# EAGLE design index (EAGLE 9.5.2)
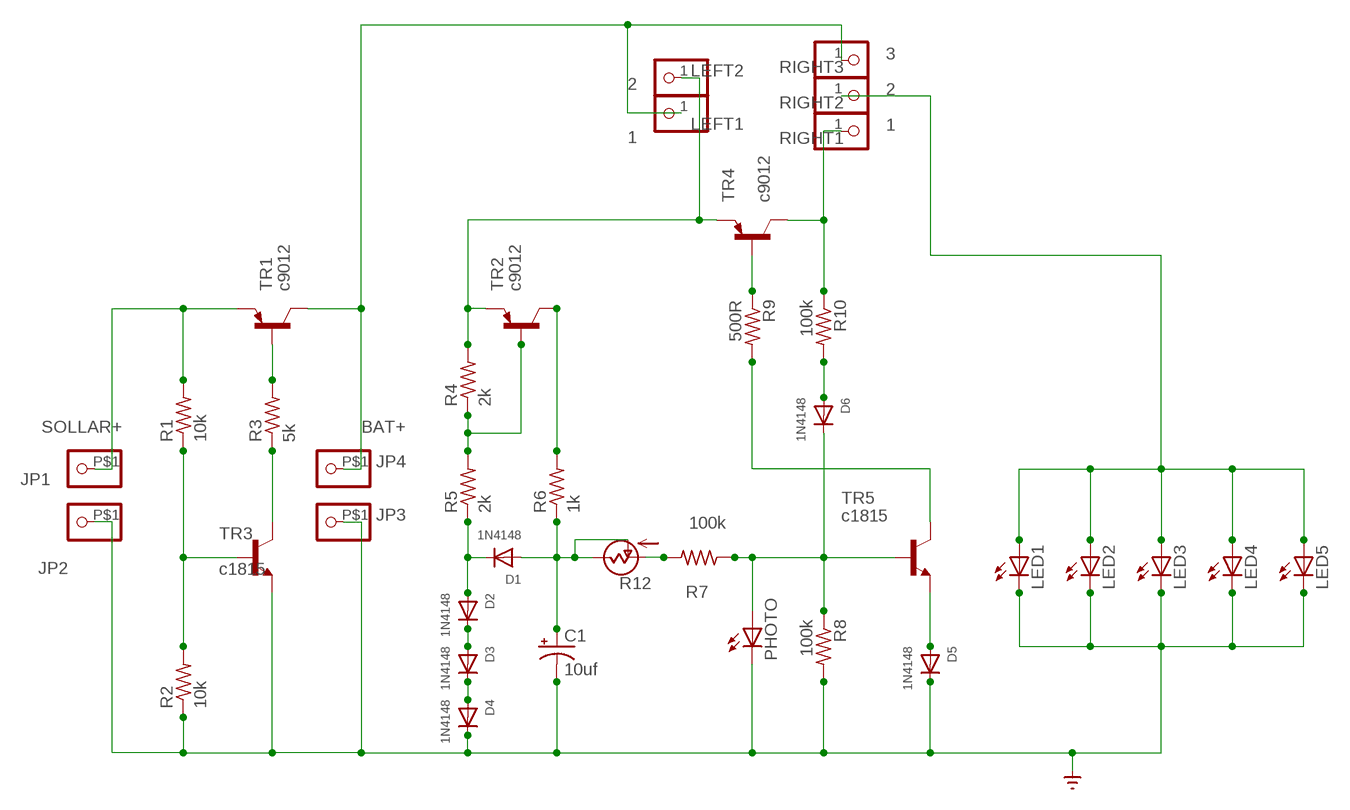
[diagram p0: schematic, sheet 1]

## Parts
C1  10uf  CAP_POLPTH2  [CPOL-RADIAL-10UF-25V]
D1  1N4148  DIODEDO-1N4148  [DO-1N4148]
D2  1N4148  DIODEDO-1N4148  [DO-1N4148]
D3  1N4148  DIODEDO-1N4148  [DO-1N4148]
D4  1N4148  DIODEDO-1N4148  [DO-1N4148]
D5  1N4148  DIODEDO-1N4148  [DO-1N4148]
D6  1N4148  DIODEDO-1N4148  [DO-1N4148]
JP1  PINHD-1X1-BIGPOGO  [1X1-BIGPOGO]
JP2  PINHD-1X1-BIGPOGO  [1X1-BIGPOGO]
JP3  PINHD-1X1-BIGPOGO  [1X1-BIGPOGO]
JP4  PINHD-1X1-BIGPOGO  [1X1-BIGPOGO]
LED1  LED3MM  [LED3MM]
LED2  LED3MM  [LED3MM]
LED3  LED3MM  [LED3MM]
LED4  LED3MM  [LED3MM]
LED5  LED3MM  [LED3MM]
LEFT1  1  PINHD-1X1CB  [1X01-CLEANBIG]
LEFT2  2  PINHD-1X1CB  [1X01-CLEANBIG]
PHOTO  LED3MM  [LED3MM]
R1  10k  R-US_0207/9  [0207/9]
R2  10k  R-US_0207/9  [0207/9]
R3  5k  R-US_0207/9  [0207/9]
R4  2k  R-US_0207/9  [0207/9]
R5  2k  R-US_0207/9  [0207/9]
R6  1k  R-US_0207/9  [0207/9]
R7  100k  R-US_0207/9  [0207/9]
R8  100k  R-US_0207/9  [0207/9]
R9  500R  R-US_0207/9  [0207/9]
R10  100k  R-US_0207/9  [0207/9]
R12  POTTRECP10S  [ECP10S]
RIGHT1  1  PINHD-1X1CB  [1X01-CLEANBIG]
RIGHT2  2  PINHD-1X1CB  [1X01-CLEANBIG]
RIGHT3  3  PINHD-1X1CB  [1X01-CLEANBIG]
TR1  c9012  2N2907  [TO92-EBC-OVAL]
TR2  c9012  2N2907  [TO92-EBC-OVAL]
TR3  c1815  BC639-NPN-TO92-ECB  [TO92-ECB]
TR4  c9012  2N2907  [TO92-EBC-OVAL]
TR5  c1815  BC639-NPN-TO92-ECB  [TO92-ECB]

## Nets
BAT+: JP4.P$1 LEFT1.1 RIGHT3.1 TR1.C
GND: C1.2(-) D4.C D5.C JP2.P$1 JP3.P$1 LED1.K(C) LED2.K(C) LED3.K(C) LED4.K(C) LED5.K(C) PHOTO.K(C) R2.1 R8.2 TR3.E ; supply symbol labelled SUPPLY0_GND_
N$1: R1.1 R2.2 TR3.B
N$4: R3.1 TR3.C
N$6: R3.2 TR1.B
N$7: D1.C D2.A R5.1
N$8: D2.C D3.A
N$9: D3.C D4.A
N$10: LEFT2.1 R4.2 TR2.E TR4.E
N$11: R4.1 R5.2 TR2.B
N$12: R6.2 TR2.C
N$13: C1.1(+) D1.A R6.1 R12.E(VSS) R12.S(OUT)
N$14: D6.C PHOTO.A R7.1 R8.1 TR5.B
N$15: D5.A TR5.E
N$16: R9.2 TR5.C
N$17: R9.1 TR4.B
N$18: R10.1 RIGHT1.1 TR4.C
N$19: D6.A R10.2
N$21: R7.2 R12.A(VDD)
N$23: LED1.A LED2.A LED3.A LED4.A LED5.A RIGHT2.1
SOLLAR+: JP1.P$1 R1.2 TR1.E

## Library data of the parts
C1 = barthess:CAP_POL: Capacitor Polarized These are standard SMD and PTH capacitors. Normally 10uF, 47uF, and 100uF in electrolytic and tantalum varieties. Always verify the external diameter of the through hole cap, it varies with capacity, voltage, and manufacturer. The EIA devices should be standard.
D1-D6 = adafruit:DIODE: Diode SMADIODE - SMA Surface Mount Package 20V 1A Schottky Diode Digikey: 641-1014-6-ND DO-1N4148 - Through Hole Small Current Diode SOD-123 20V 1 A (.5mV Vf) Schottky Diode - Digikey: MBRX120TPMSCT-ND SOD-323 10V 570mA (.38mV Vf, 3ns) Schottky Diode - Digikey: ZLLS410CT-ND SOD-523 30V 30mA Schottky Diode (RB751S-40TE61) - Digikey: RB751S-40TE61CT-ND SOT23-R/W - SOT23 Package (R = Solder Paste/Reflow Ovens, W = Hand-Soldering) BAT54Film 40V 300mA - Digikey: 497-7162-1-ND
JP1-JP4 LEFT1 LEFT2 RIGHT1-RIGHT3 = adafruit:PINHD-1X1: Pin header 1x1 for 0.1" spacing With round pins
LED1-LED5 PHOTO = adafruit:LED: LED OSRAM: - CHIPLED LG R971, LG N971, LY N971, LG Q971, LY Q971, LO R971, LY R971 LH N974, LH R974 LS Q976, LO Q976, LY Q976 LO Q996 - Hyper CHIPLED LW Q18S LB Q993, LB Q99A, LB R99A - SideLED LS A670, LO A670, LY A670, LG A670, LP A670 LB A673, LV A673, LT A673, LW A673 LH A674 LY A675 LS A676, LA A676, LO A676, LY A676, LW A676 LS A679, LY A679, LG A679 - Hyper Micro SIDELED® LS Y876, LA Y876, LO Y876, LY Y876 LT Y87S - SmartLED LW L88C, LW L88S LB L89C, LB L89S, LG L890 LS L89K, LO L89K, LY L89K LS L896, LA L896, LO L896, LY L896 - TOPLED LS T670, LO T670, LY T670, LG T670, LP T670 LSG T670, LSP T670, LSY T670, LOP T670, LYG T670 LG T671, LOG T671, LSG T671 LB T673, LV T673, LT T673, LW T673 LH T674 LS T676, LA T676, LO T676, LY T676, LB T676, LH T676, LSB T676, LW T676 LB T67C, LV T67C, LT T67C, LS T67K, LO T67K, LY T67K, LW E67C LS E67B, LA E67B, LO E67B, LY E67B, LB E67C, LV E67C, LT E67C LW T67C LS T679, LY T679, LG T679 LS T770, LO T770, LY T770, LG T770, LP T770 LB T773, LV T773, LT T773, LW T773 LH T774 LS E675, LA E675, LY E675, LS T675 LS T776, LA T776, LO T776, LY T776, LB T776 LHGB T686 LT T68C, LB T68C - Hyper Mini TOPLED® LB M676 - Mini TOPLED Santana® LG M470 LS M47K, LO M47K, LY M47K Source: http://www.osram.convergy.de/
R1-R10 = adafruit:R-US_: RESISTOR, American symbol
R12 = tango:POTTR: POTENTIOMETER
TR1 TR2 TR4 = adafruit:2N2907*: PNP Transistor Big Oval pads
TR3 TR5 = transistor:*-NPN-: NPN Transistror BF959 corrected 2008.03.06

## Board
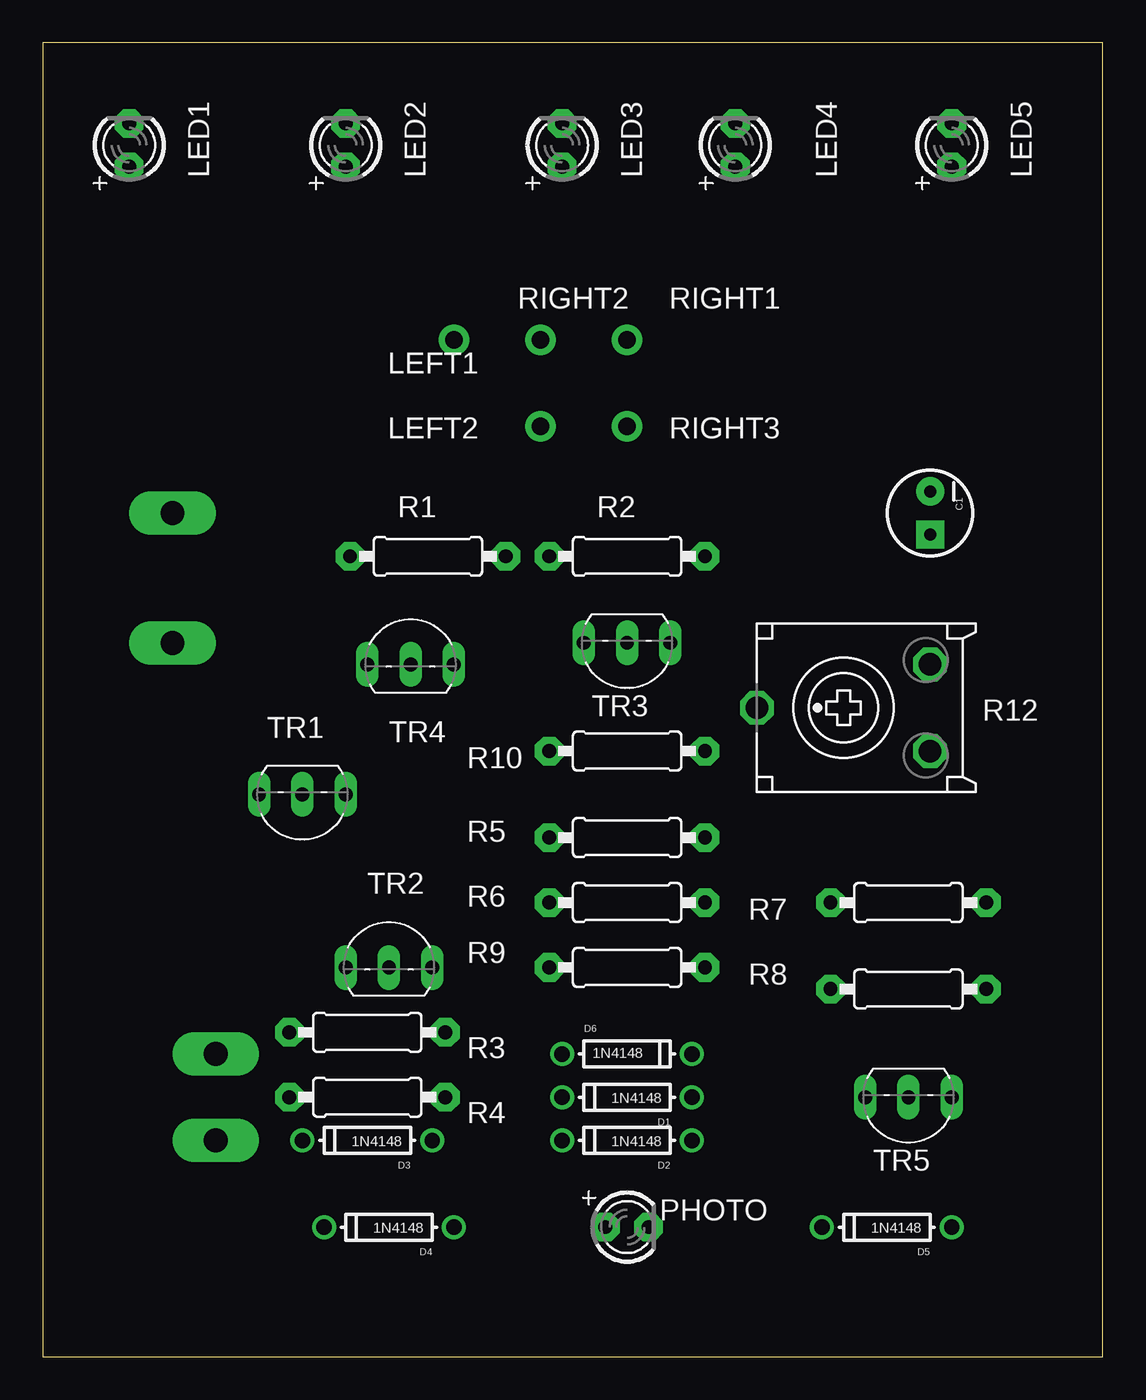
[diagram p1: board, top side]
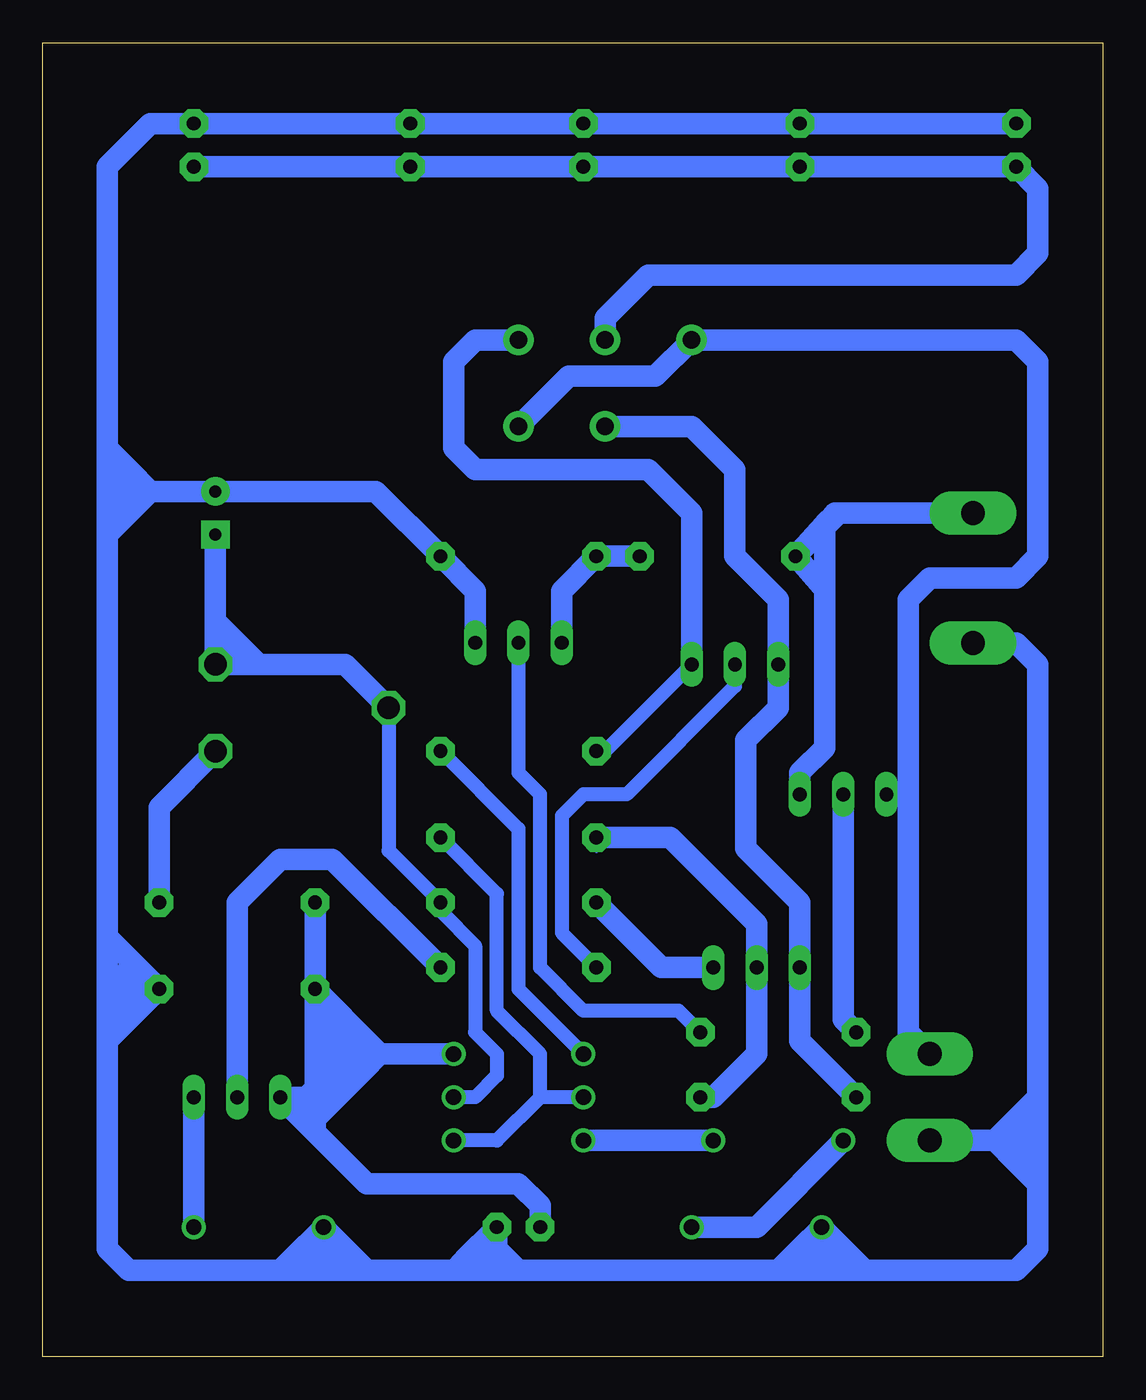
[diagram p2: board, bottom side, seen from below]

Size 62.21 x 77.14 mm. Coordinates in mm from the lower left corner, seen from the top.
Outline: 0,0 62.21,0 62.21,77.14 0,77.14 0,0
Copper layers (1*16): Top 0.035mm / dielectric 1.5mm / Bottom 0.035mm
Design rules "default": minimum track width 6mil, minimum drill 0.35mm, track to track 6mil, track to pad 6mil, pad to pad 6mil, via to via 6mil, smd to smd 6mil, copper to edge 40mil, drill to drill 6mil, minimum pad ring 10mil, minimum via ring 8mil, stop-mask expansion 4mil, vias tented up to drill 0mil, thermal gap 10mil

### Footprints (pad centres in the part's own frame; a part is rotated, then mirrored left to right if it is on the bottom)
CPOL-RADIAL-10UF-25V = drill 0.7 pad 1.651 square: 1 1.27,0 | drill 0.7 pad 1.651: 2 -1.27,0
DO-1N4148 = drill 0.9: A -3.81,0; C 3.81,0
1X1-BIGPOGO = drill 1.4 pad 2.54 long: P$1 0,0
LED3MM = drill 0.813 pad 1.676 octagon: A -1.27,0; K 1.27,0
1X01-CLEANBIG = drill 1.016 pad 1.778: 1 0,0
0207/9 = drill 0.813 pad 1.676 octagon: 1 -4.572,0; 2 4.572,0
ECP10S = drill 1.321 octagon: A -2.54,-5.08; E 2.54,-5.08; S 0,5.08
TO92-EBC-OVAL = drill 0.813 long: B 0,-1.27; C 2.54,-1.27; E -2.54,-1.27
TO92-ECB = drill 0.813 long: B 2.54,0; C 0,0; E -2.54,0

### Placement (x,y rotation side)
C1  52.07,49.53 270 top
D1  34.29,15.24 180 top
D2  34.29,12.7 180 top
D3  19.05,12.7 180 top
D4  20.32,7.62 180 top
D5  49.53,7.62 180 top
D6  34.29,17.78 0 top
JP1  7.62,49.53 0 top
JP2  7.62,41.91 0 top
JP3  10.16,12.7 0 top
JP4  10.16,17.78 0 top
LED1  5.08,71.12 90 top
LED2  17.78,71.12 90 top
LED3  30.48,71.12 90 top
LED4  40.64,71.12 90 top
LED5  53.34,71.12 90 top
LEFT1  24.13,59.69 0 top
LEFT2  29.21,54.61 0 top
PHOTO  34.29,7.62 0 top
R1  22.61,46.99 180 top
R2  34.29,46.99 180 top
R3  19.05,19.05 180 top
R4  19.05,15.24 180 top
R5  34.29,30.48 180 top
R6  34.29,26.67 180 top
R7  50.8,26.67 0 top
R8  50.8,21.59 0 top
R9  34.29,22.86 0 top
R10  34.29,35.56 0 top
R12  46.99,38.1 90 top
RIGHT1  34.29,59.69 0 top
RIGHT2  29.21,59.69 0 top
RIGHT3  34.29,54.61 0 top
TR1  15.24,31.75 180 top
TR2  20.32,24.13 0 top
TR3  34.29,41.91 180 top
TR4  21.59,41.91 0 top
TR5  50.8,15.24 180 top

### Tracks (layer width: path | path; a pad name or v marks a point on that pad's centre or on a via)
BAT+
  Bottom 1.27: 11.43,33.02 11.43,44.45 10.16,45.72 5.08,45.72 3.81,46.99 3.81,58.42 5.08,59.69 LEFT1.1 26.26,57.56 31.34,57.56 RIGHT3.1 | 11.43,33.02 11.43,19.05 JP4.P$1 | 11.43,33.02 TR1.C
GND
  Bottom 1.27: 35.56,6.35 35.56,5.08 | 35.56,5.08 38.1,5.08 | 38.1,5.08 43.18,5.08 | 43.18,5.08 44.45,5.08 | 44.45,5.08 45.72,5.08 | 45.72,5.08 45.72,6.35 | 45.72,6.35 D5.C | 45.72,5.08 48.26,5.08 | 58.42,21.59 58.42,24.64 | 58.42,24.64 58.42,48.26 | 58.42,48.26 58.42,49.53 | 58.42,49.53 58.42,50.8 | 58.42,50.8 55.88,50.8 | 55.88,50.8 C1.2 42.67,50.8 R2.1 36.83,44.96 TR3.E | 16.51,5.08 17.78,5.08 | LED2.K LED4.K LED5.K 55.88,72.39 58.42,69.85 58.42,53.34 | LED3.K LED2.K | LED2.K LED1.K | 3.81,15.24 3.81,12.7 | 3.81,12.7 6.35,12.7 | 6.35,12.7 JP3.P$1 | 58.42,18.54 58.42,20.32 | 58.42,20.32 58.42,21.59 | 58.42,53.34 58.42,50.8 | 13.97,5.08 5.08,5.08 3.81,6.35 3.81,10.16 | 13.97,5.08 15.24,5.08 | 15.24,5.08 16.51,5.08 | 3.81,12.7 3.81,10.16 | 3.81,15.24 5.08,13.97 | 5.08,13.97 6.35,12.7 | 3.81,10.16 5.08,11.43 | 5.08,11.43 6.35,12.7 | 5.08,13.97 5.08,11.43 | R8.2 58.42,21.59 | R8.2 56.9,23.11 | 56.9,23.11 58.42,24.64 | R8.2 58.42,18.54 | 58.42,20.32 57.15,21.59 57.15,22.86 56.9,23.11 | JP2.P$1 5.08,41.91 3.81,40.64 3.81,15.24 | 55.88,50.8 57.15,52.07 | 57.15,52.07 58.42,53.34 | 55.88,50.8 58.42,48.26 | 58.42,49.53 57.15,50.8 57.15,52.07 | 13.97,5.08 D4.C | D4.C 17.78,6.35 | 17.78,6.35 17.78,5.08 | 16.51,5.08 D4.C | 15.24,5.08 16.51,6.35 17.78,6.35 | 17.78,5.08 19.05,5.08 | 19.05,5.08 34.29,5.08 | 34.29,5.08 35.56,5.08 | 19.05,5.08 17.78,6.35 | 43.18,5.08 D5.C | 44.45,5.08 45.72,6.35 | D5.C 47.62,5.71 | 47.62,5.71 48.26,5.08 | 47.62,5.71 46.35,5.71 45.72,6.35 | 35.56,6.35 PHOTO.K 37.47,5.71 | 35.56,6.35 34.29,5.08 | 37.47,5.71 38.1,5.08 | 37.47,5.71 36.2,5.71 35.56,6.35 | 48.26,5.08 57.15,5.08 58.42,6.35 58.42,18.54
N$1
  Bottom 1.27: R1.1 R2.2 31.75,44.96 TR3.B
N$4
  Bottom 0.813: R3.1 24.89,20.32 30.48,20.32 33.02,22.86 33.02,33.02 34.29,34.29 TR3.C
N$6
  Bottom 1.27: R3.2 15.24,19.81 TR1.B
N$7
  Bottom 0.813: R5.1 35.56,27.18 35.56,20.32 33.02,17.78 33.02,15.24 | 33.02,15.24 35.56,12.7 D2.A | D1.C 33.02,15.24
N$8
  Bottom 1.27: D3.A D2.C
N$9
  Bottom 1.27: D4.A 20.32,7.62 D3.C
N$10
  Bottom 1.27: R4.2 17.78,18.54 TR2.E 17.78,26.67 20.95,29.84 20.95,36.2 19.05,38.1 TR4.E 19.05,44.45 21.59,46.99 21.59,52.07 24.13,54.61 LEFT2.1
N$11
  Bottom 0.305: 29.72,29.72 R5.2
  Bottom 1.27: R4.1 22.86,15.24 20.32,17.78 TR2.B 20.32,25.4 25.4,30.48 R5.2
N$12
  Bottom 1.27: R6.2 25.91,22.86 TR2.C
N$13
  Bottom 0.305: 36.83,21.59 36.83,19.05
  Bottom 0.813: R12.S 41.91,29.72 R6.1 38.86,26.16 36.83,24.13 36.83,19.05 35.56,17.78 35.56,16.51 36.83,15.24 D1.A
  Bottom 1.27: C1.1 52.07,43.18 | 52.07,43.18 52.07,41.91 | 52.07,41.91 R12.E 50.8,40.64 | R12.S 44.45,40.64 49.53,40.64 | 49.53,40.64 50.8,40.64 | 49.53,40.64 52.07,43.18 | 50.8,40.64 52.07,41.91
N$14
  Bottom 0.813: 44.45,18.16 46.23,16.38 46.23,15.24
  Bottom 1.27: R8.1 R7.1 46.23,25.91 | R8.1 46.23,19.81 | 46.23,17.78 46.23,16 | PHOTO.A 33.02,8.89 34.29,10.16 43.18,10.16 46.35,13.34 | 46.23,15.75 46.74,15.24 TR5.B 46.35,13.34 | 42.42,17.78 42.8,18.16 | 42.8,18.16 R8.1 | D6.C 42.42,17.78 | 46.35,13.34 46.23,13.46 46.23,13.97 | 46.23,13.97 46.23,15.24 | 46.23,15.24 46.23,15.75 | 42.8,18.16 44.45,18.16 | 42.42,17.78 44.45,17.78 | 44.45,17.78 46.23,17.78 | 46.23,18.54 46.23,19.81 | 46.23,19.81 45.72,20.32 45.09,19.68 | 45.09,19.68 44.45,19.05 44.45,18.16 | 45.09,19.68 46.23,18.54 | 46.23,18.54 46.23,17.78 | 46.23,17.78 45.85,18.16 44.45,18.16 | 42.42,17.78 43.43,16.76 | 43.43,16.76 46.23,13.97 | 44.45,17.78 46.23,16 | 46.23,16 46.23,15.75 | 46.23,15.24 44.7,16.76 43.43,16.76
N$15
  Bottom 1.27: TR5.E D5.A
N$16
  Bottom 1.27: TR5.C 50.8,26.67 48.26,29.21 45.21,29.21 R9.2
N$17
  Bottom 0.813: R9.1 31.75,24.89 31.75,31.75 30.48,33.02 27.94,33.02 21.59,39.37 TR4.B
N$18
  Bottom 0.813: TR4.C 29.21,35.56 R10.1
  Bottom 1.27: TR4.C 24.13,49.53 26.67,52.07 36.83,52.07 38.1,53.34 38.1,58.42 36.83,59.69 RIGHT1.1
N$19
  Bottom 0.305: 34.29,27.94 34.29,21.59
  Bottom 0.813: D6.A 34.29,21.59 34.29,30.99 R10.2
N$21
  Bottom 1.27: R7.2 55.37,32.26 R12.A
N$23
  Bottom 0.305: 25.4,63.5 8.89,63.5 7.62,63.5
  Bottom 1.27: LED5.A LED4.A LED3.A LED2.A LED1.A 3.81,68.58 3.81,64.77 5.08,63.5 8.89,63.5 26.67,63.5 29.21,60.96 RIGHT2.1
SOLLAR+
  Bottom 1.27: JP1.P$1 13.97,49.53 15.49,49.53 | 15.49,49.53 15.75,49.53 16.09,49.15 | 16.09,49.15 R1.2 | R1.2 16.33,45.03 | 16.33,45.03 16.33,35.74 17.78,34.29 TR1.E | 16.33,45.03 16.33,48.91 16.09,49.15 | 15.49,49.53 R1.2